# EAGLE schematic v7-flex2811 (EAGLE 7.3.0)
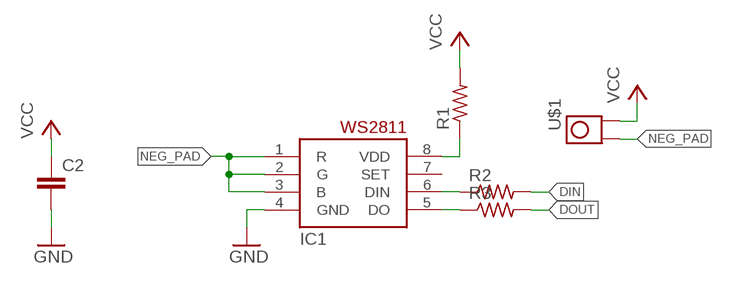
[diagram p0: schematic, sheet 1]

## Parts
C2  C-EUC0402  [C0402]
IC1  WS2811-SOP8  [SO08-SKINNYPADS]
R1  R-US_R0402  [R0402]
R2  R-US_R0402  [R0402]
R3  R-US_R0402  [R0402]
U$1  TP_4MM_MED_PAD  [TP_4MM_MED_PAD]

## Nets
DIN: R2.2
DOUT: R3.2
GND: C2.2 IC1.4(GND)
N$1: IC1.8(VDD) R1.1
N$2: IC1.6(DIN) R2.1
N$3: IC1.5(DO) R3.1
NEG_PAD: IC1.1(R) IC1.2(G) IC1.3(B) U$1.P$1
VCC: C2.1 R1.2 U$1.P$2
Unconnected: IC1.7(SET)

## Library data of the parts
C2 = rcl:C-EU: CAPACITOR, European symbol
IC1 = adafruit:WS2811
R1-R3 = rcl:R-US_: RESISTOR, American symbol
U$1 = tom-tappytap-v5-flex:TP_4MM_MED_PAD